# EasyEDA schematic sheet.json
TITLE: Sheet_1; REV: 1.0; Date: 2021-03-17; Sheet: 1/1; Company: Your Company
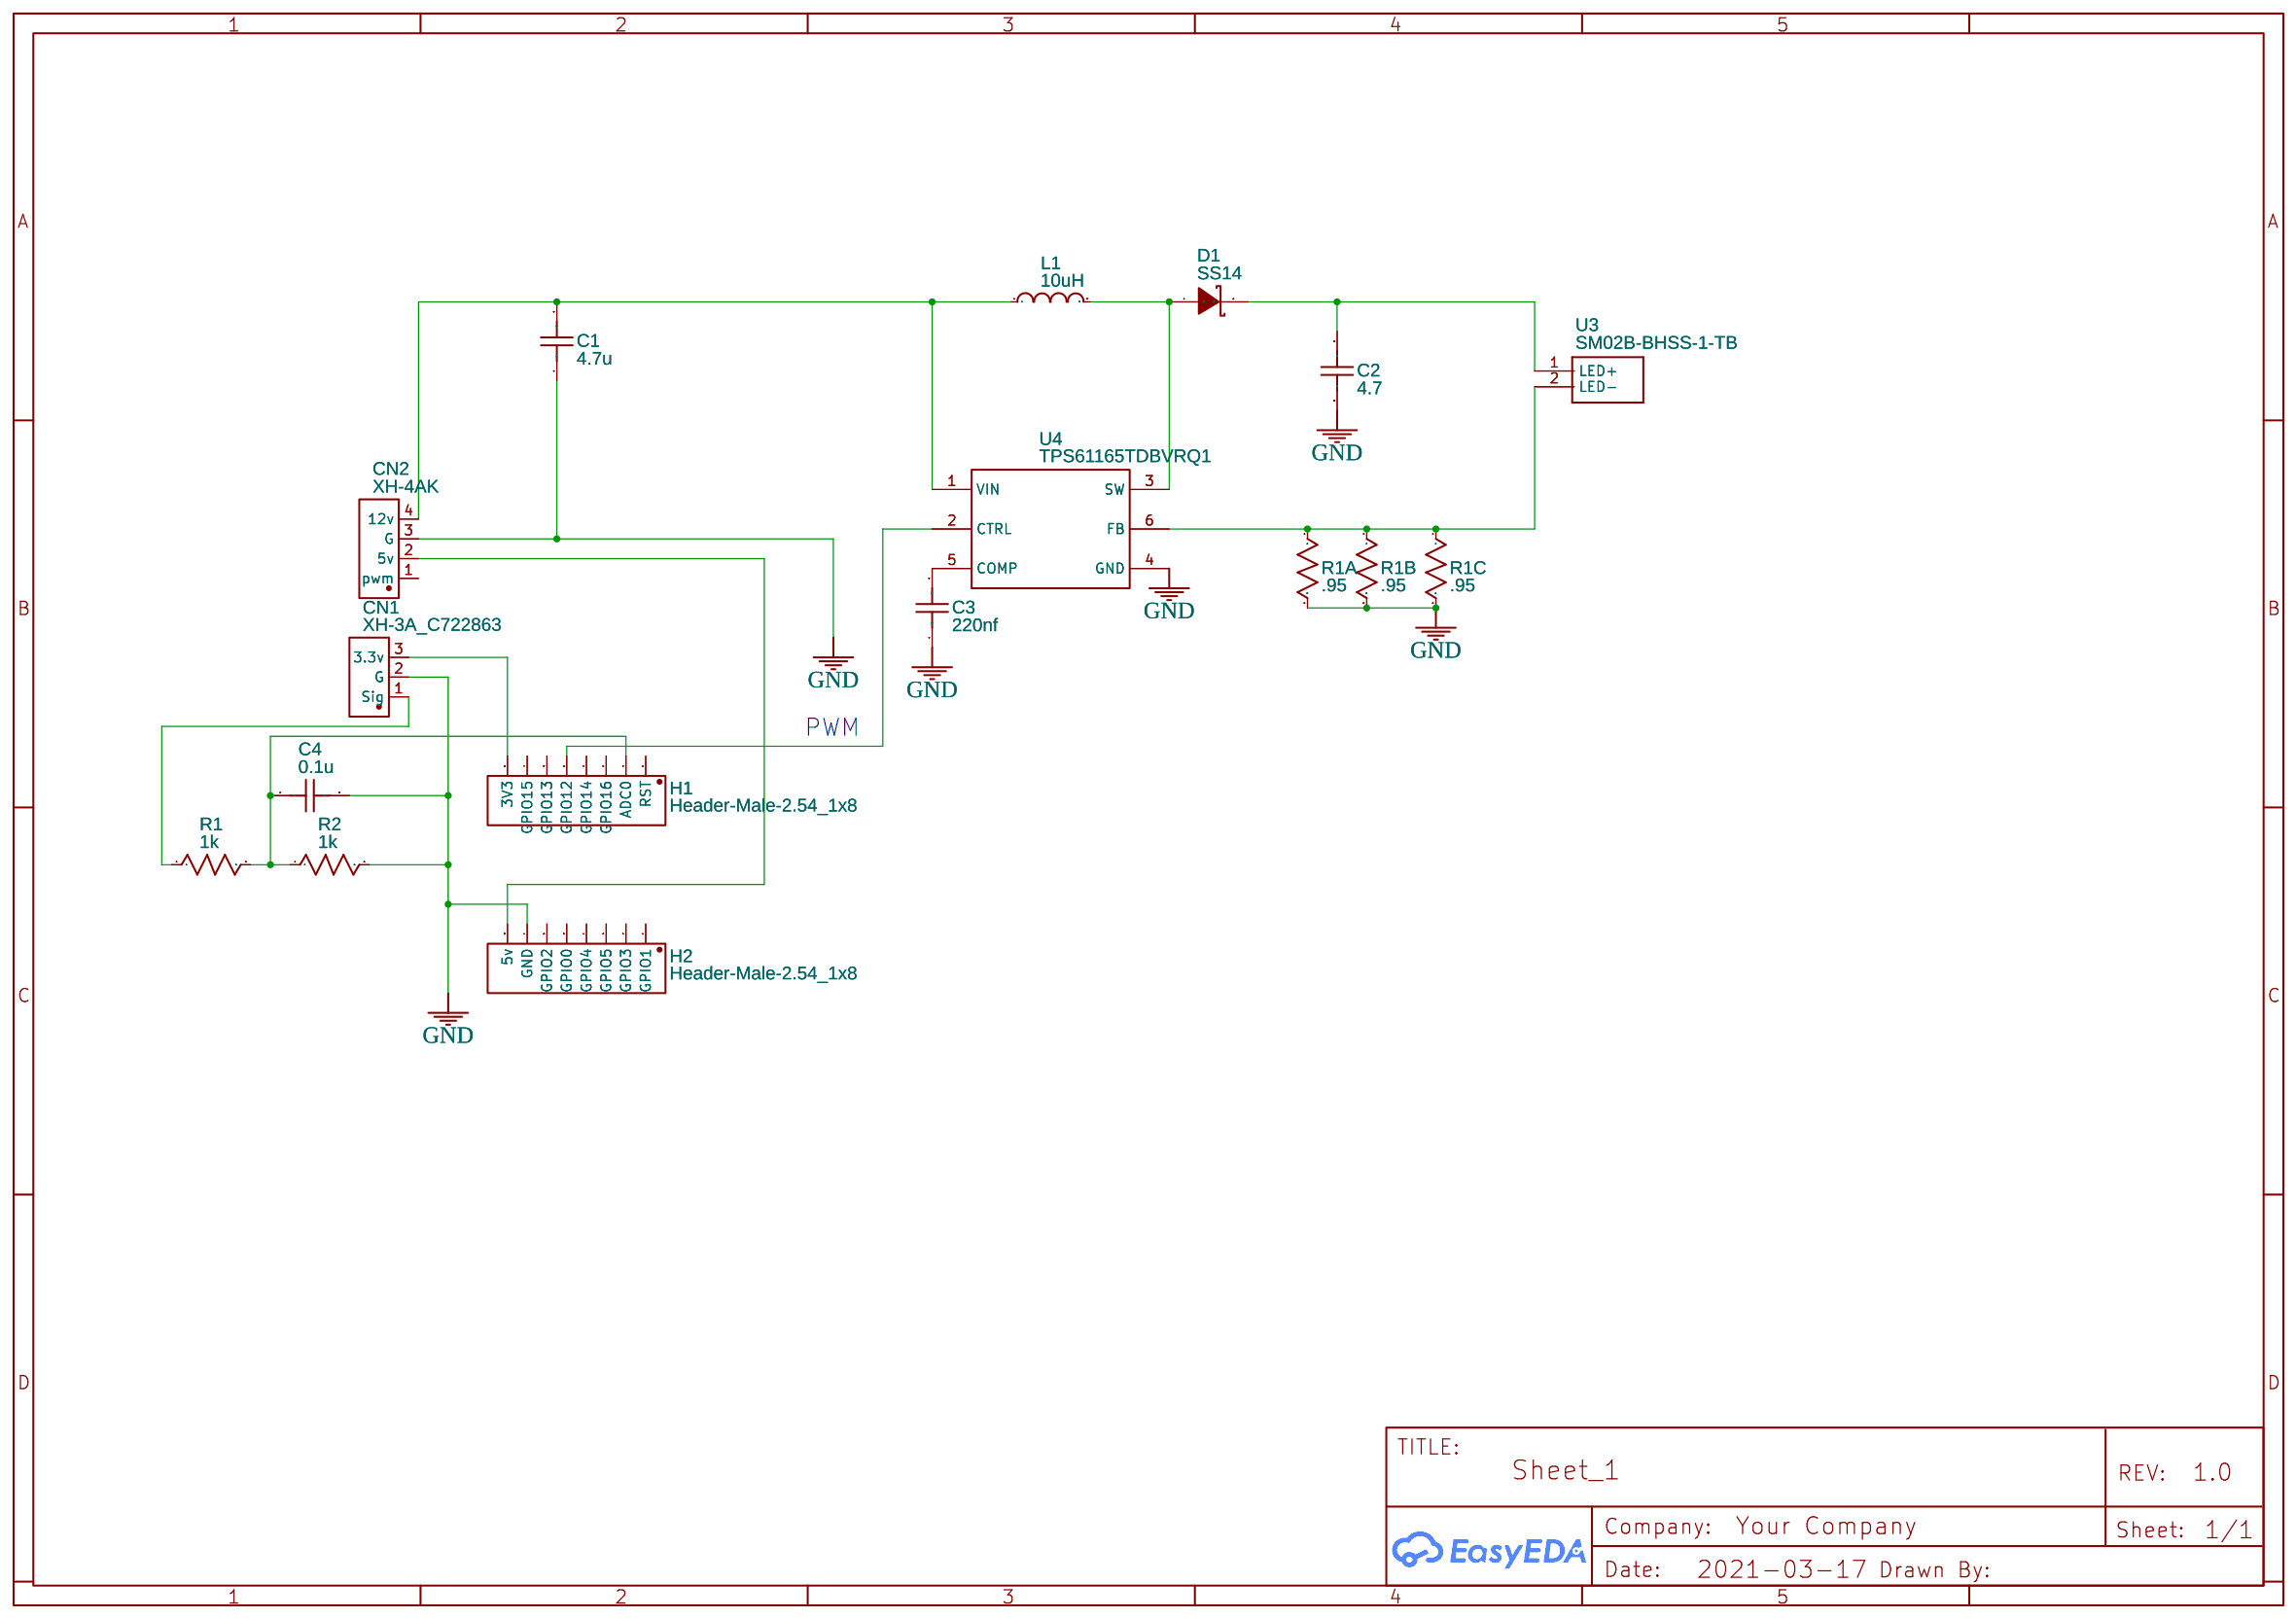
[diagram p0: schematic sheet]

## Parts
C1  4.7u  [C0603]
C2  4.7  [C0603]
C3  220nf  [C0603]
C4  0.1u  [C0603]
CN1  XH-3A_C722863  [CONN-TH_C722693]
CN2  XH-4AK  [CONN-TH_XH-4AK]
D1  SS14  [SMA(DO-214AC)]
H1  Header-Male-2.54_1x8  [HDR-TH_8P-P2.54-V-M]
H2  Header-Male-2.54_1x8  [HDR-TH_8P-P2.54-V-M]
L1  10uH  [IND-SMD_L5.0-W5.0_VLCF5020T]
R1  1k  [R0603]
R1A  .95  [R0603]
R1B  .95  [R0603]
R1C  .95  [R0603]
R2  1k  [R0603]
U3  SM02B-BHSS-1-TB  [SM02B-BHSS-1-TB]
U4  TPS61165TDBVRQ1  [SOT-23-6]

## Library data of the parts
C1-C4 = C_0603_US: Contributor: LCEDA_Lib
CN1 = XH-3A_C722863: Supplier: LCSC; Supplier Part: C722863; Manufacturer: CAX; Manufacturer Part: XH-3A; Contributor: LCSC; LCSC Assembly: Yes; SMT Type: Extend; Paste Type: expand
CN2 = XH-4AK: Supplier: LCSC; Supplier Part: C722871; Manufacturer: CAX; Contributor: LCSC; LCSC Assembly: Yes; SMT Type: Extend; Paste Type: expand; Package Display: No
D1 = SS14: Supplier Part: C2480; Supplier: LCSC; Manufacturer: MDD
H1 = Header-Male-2.54_1x8: Supplier: LCSC; Manufacturer: Ckmtw; Manufacturer Part: 210S-1*8P L=11.6MMGold-plated black; Contributor: LCSC; Supplier Part: C124381; LCSC Assembly: Yes; SMT Type: Extend; Paste Type: expand
H2 = Header-Male-2.54_1x8: Supplier: LCSC; Manufacturer: Ckmtw; Manufacturer Part: 210S-1*8P L=11.6MMGold-plated black; Contributor: LCSC; Supplier Part: C124381; LCSC Assembly: Yes; SMT Type: Extend; Paste Type: expand; Package Display: No
L1 = VLCF5020T-100M1R1-1: Supplier: LCSC; Manufacturer: TDK; Supplier Part: C89448
R1 R1A R1B R1C R2 = R_0603_US: Contributor: LCEDA_Lib
U3 = SM02B-BHSS-1-TB: Contributor: chansainlong
U4 = TPS61165TDBVRQ1: Automotive Catalog High Brightness White LED Driver, 3 to 18 V, -40 to 105 degC, 6-pin SOT23 (DBV6), Green (RoHS  no SbBr)

## Nets
GND: C1.1 C2.2 C3.1 C4.2 CN1.2(G) CN2.3(G) H2.7(GND) R1A.2 R1B.2 R1C.2 R2.2 U4.4(GND)
Net-(C1-2): C1.2 CN2.4(12v) L1.1 U4.1(VIN)
Net-(C2-1): C2.1 D1.2(K) U3.1(LED+)
Net-(C3-2): C3.2 U4.5(COMP)
Net-(C4-1): C4.1 H1.2(ADC0) R1.2 R2.1
Net-(CN1-1): CN1.1(Sig) R1.1
Net-(CN1-3): CN1.3(3.3v) H1.8(3V3)
Net-(CN2-2): CN2.2(5v) H2.8(5v)
Net-(D1-1): D1.1(A) L1.2 U4.3(SW)
Net-(H1-5): H1.5(GPIO12) U4.2(CTRL)
Net-(R1A-1): R1A.1 R1B.1 R1C.1 U3.2(LED-) U4.6(FB)

Not connected (* = marked no-connect by the designer): CN2 1(pwm); H1 1(RST) 3(GPIO16) 4(GPIO14) 6(GPIO13) 7(GPIO15); H2 1(GPIO1) 2(GPIO3) 3(GPIO5) 4(GPIO4) 5(GPIO0) 6(GPIO2)

## Notes on the sheet
- PWM
